# Altium project PCB_ProjectInz.PrjPcb
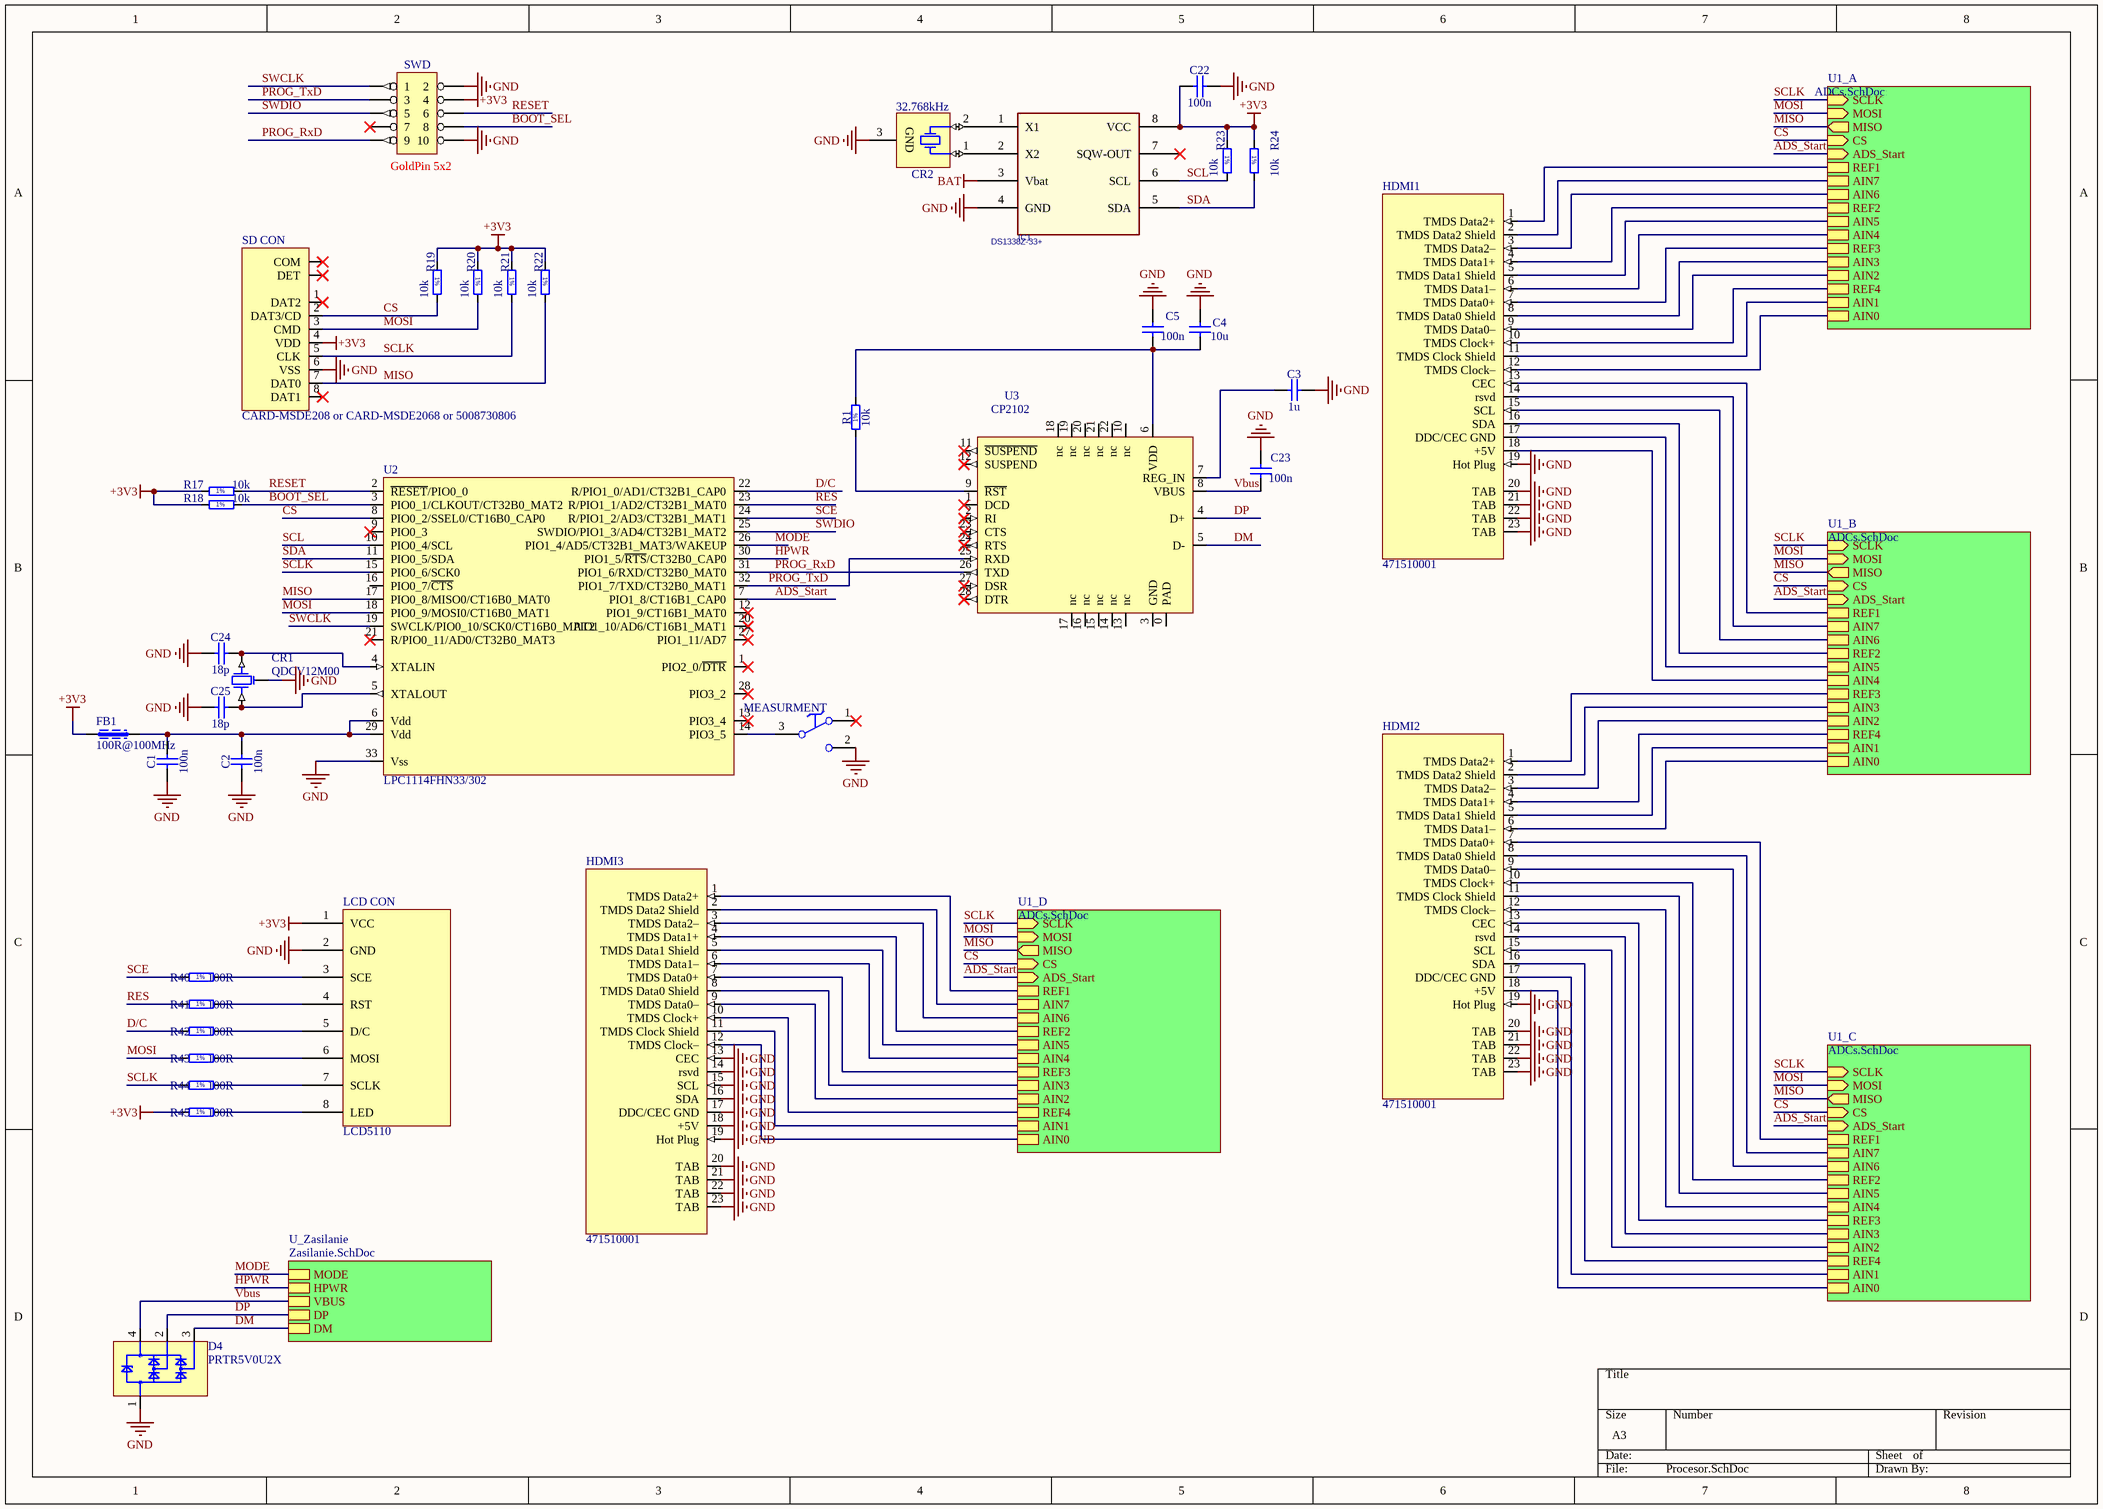
[diagram p0: Procesor.SchDoc]
3 sheets, 104 parts. Net scope: hierarchical (ports join the sheet entries above them; power ports are global).
Board file: PCB.PcbDoc
Sheets:
  Procesor.SchDoc
    U1_A = ADCs.SchDoc
    U1_B = ADCs.SchDoc
    U1_C = ADCs.SchDoc
    U1_D = ADCs.SchDoc
    U_Zasilanie = Zasilanie.SchDoc

## Sheet Procesor.SchDoc
size A3

### Parts
C1  100n  [CAPC1005X55N]
C2  100n  [CAPC1005X55N]
C3  1u  [CAPC1608X87N]
C4  10u  [CAPC2012X135N]
C5  100n  [CAPC1005X55N]
C22  100n  [CAPC1005X55N]
C23  100n  [CAPC1005X55N]
C24  18p  [CAPC1608X87N]
C25  18p  [CAPC1608X87N]
CR1  QDCV12M00  [CERAMIC_RES_QDCV]
CR2  32.768kHz  [XTAL_MICRO-CRYSTAL_MS3V-T1R]
D4  PRTR5V0U2X  [sot143b]
FB1  100R@100MHz  [0603L]
HDMI1  471510001  [HDMI_471510001]
HDMI2  471510001  [HDMI_471510001]
HDMI3  471510001  [HDMI_471510001]
IC1  DS1338Z-33+  [SO-8]
LCD_CON  LCD5110  [Goldpin1x8SMD]
MEASURMENT  Switch  [SW_MENTOR_1850]  (value not drawn)
R1  10k  [RESC1005X40N]
R17  10k  [RESC1608X55N]
R18  10k  [RESC1608X55N]
R19  10k  [RESC1005X40N]
R20  10k  [RESC1005X40N]
R21  10k  [RESC1005X40N]
R22  10k  [RESC1005X40N]
R23  10k  [RESC1005X40N]
R24  10k  [RESC1005X40N]
R40  100R  [RESC1005X40N]
R41  100R  [RESC1005X40N]
R42  100R  [RESC1005X40N]
R43  100R  [RESC1005X40N]
R44  100R  [RESC1005X40N]
R45  100R  [RESC1005X40N]
SD_CON  CARD-MSDE208 or CARD-MSDE2068 or 5008730806  [MSDE208]
SWD  GoldPin 5x2  [CON_2x5_MINI]
U2  LPC1114FHN33/302  [HVQFN33_QFN127P600-8N]
U3  CP2102  [QFN28]

### Sub-sheets
U1_A = ADCs.SchDoc: SCLK (in), MOSI (in), MISO (out), CS (in), ADS_Start (in), REF1, AIN7, AIN6, REF2, AIN5, AIN4, REF3, AIN3, REF4, AIN2, AIN1, AIN0
U1_B = ADCs.SchDoc: SCLK (in), MOSI (in), MISO (out), CS (in), ADS_Start (in), REF1, AIN7, AIN6, REF2, AIN5, AIN4, REF3, AIN3, REF4, AIN2, AIN1, AIN0
U1_C = ADCs.SchDoc: SCLK (in), MOSI (in), MISO (out), CS (in), ADS_Start (in), REF1, AIN7, AIN6, REF2, AIN5, AIN4, REF3, AIN3, REF4, AIN2, AIN1, AIN0
U1_D = ADCs.SchDoc: SCLK (in), MOSI (in), MISO (out), CS (in), ADS_Start (in), REF1, AIN7, AIN6, REF2, AIN5, AIN4, REF3, AIN3, REF4, AIN2, AIN1, AIN0
U_Zasilanie = Zasilanie.SchDoc: DM, DP, VBUS, HPWR, MODE

### Nets
+3V3: C22.1 FB1.1 IC1.8(VCC) LCD_CON.1(VCC) R17.1 R18.1 R19.1 R20.1 R21.1 R22.1 R23.1 R24.1 R45.1 SD_CON.4(VDD) SWD.4
BAT: IC1.3(Vbat)
GND: C1.1 C2.1 C3.2 C4.1 C5.2 C22.2 C23.2 C24.1 C25.1 CR1.2 CR2.3(GND) D4.1 HDMI1.19(Hot_Plug) HDMI1.20(TAB) HDMI1.21(TAB) HDMI1.22(TAB) HDMI1.23(TAB) HDMI2.19(Hot_Plug) HDMI2.20(TAB) HDMI2.21(TAB) HDMI2.22(TAB) HDMI2.23(TAB) HDMI3.13(CEC) HDMI3.14(rsvd) HDMI3.15(SCL) HDMI3.16(SDA) HDMI3.17(DDC/CEC_GND) HDMI3.18(+5V) HDMI3.19(Hot_Plug) HDMI3.20(TAB) HDMI3.21(TAB) HDMI3.22(TAB) HDMI3.23(TAB) IC1.4(GND) LCD_CON.2(GND) MEASURMENT.2 SD_CON.6(VSS) SWD.2 SWD.10 U2.33(Vss)
Vbus: C23.1 D4.4 U3.8(VBUS) ; sheet U_Zasilanie/VBUS
ADS_Start: U2.7(PIO1_8/CT16B1_CAP0) ; sheet U1_A/ADS_Start, sheet U1_B/ADS_Start, sheet U1_C/ADS_Start, sheet U1_D/ADS_Start
BOOT_SEL: R18.2 SWD.8 U2.3(PIO0_1/CLKOUT/CT32B0_MAT2)
CS: R19.2 SD_CON.2(DAT3/CD) U2.8(PIO0_2/SSEL0/CT16B0_CAP0) ; sheet U1_A/CS, sheet U1_B/CS, sheet U1_C/CS, sheet U1_D/CS
D/C: R42.1 U2.22(R/PIO1_0/AD1/CT32B1_CAP0)
DM: D4.3 U3.5(D-) ; sheet U_Zasilanie/DM
DP: D4.2 U3.4(D+) ; sheet U_Zasilanie/DP
HPWR: U2.30(PIO1_5/~{RTS}/CT32B0_CAP0) ; sheet U_Zasilanie/HPWR
MISO: R22.2 SD_CON.7(DAT0) U2.17(PIO0_8/MISO0/CT16B0_MAT0) ; sheet U1_A/MISO, sheet U1_B/MISO, sheet U1_C/MISO, sheet U1_D/MISO
MODE: U2.26(PIO1_4/AD5/CT32B1_MAT3/WAKEUP) ; sheet U_Zasilanie/MODE
MOSI: R20.2 R43.1 SD_CON.3(CMD) U2.18(PIO0_9/MOSI0/CT16B0_MAT1) ; sheet U1_A/MOSI, sheet U1_B/MOSI, sheet U1_C/MOSI, sheet U1_D/MOSI
PROG_RxD: SWD.9 U2.31(PIO1_6/RXD/CT32B0_MAT0) U3.26(TXD)
PROG_TxD: SWD.3 U2.32(PIO1_7/TXD/CT32B0_MAT1) U3.25(RXD)
RES: R41.1 U2.23(R/PIO1_1/AD2/CT32B1_MAT0)
RESET: R17.2 SWD.6 U2.2(~{RESET}/PIO0_0)
SCE: R40.1 U2.24(R/PIO1_2/AD3/CT32B1_MAT1)
SCL: IC1.6(SCL) R23.2 U2.10(PIO0_4/SCL)
SCLK: R21.2 R44.1 SD_CON.5(CLK) U2.15(PIO0_6/SCK0) ; sheet U1_A/SCLK, sheet U1_B/SCLK, sheet U1_C/SCLK, sheet U1_D/SCLK
SDA: IC1.5(SDA) R24.2 U2.11(PIO0_5/SDA)
SWCLK: SWD.1 U2.19(SWCLK/PIO0_10/SCK0/CT16B0_MAT2)
SWDIO: SWD.5 U2.25(SWDIO/PIO1_3/AD4/CT32B1_MAT2)
NetC1_2: C1.2 C2.2 FB1.2 U2.6(Vdd) U2.29(Vdd)
NetC3_1: C3.1 U3.7(REG_IN)
NetC4_2: C4.2 C5.1 R1.2 U3.6(VDD)
NetC24_2: C24.2 CR1.1 U2.4(XTALIN)
NetC25_2: C25.2 CR1.3 U2.5(XTALOUT)
NetCR2_1: CR2.1(X) IC1.2(X2)
NetCR2_2: CR2.2(X) IC1.1(X1)
NetD1A_1: HDMI1.1(TMDS_Data2+) HDMI1.4(TMDS_Data1+) HDMI1.7(TMDS_Data0+) HDMI1.10(TMDS_Clock+) ; sheet U1_A/REF1, sheet U1_A/REF2, sheet U1_A/REF3, sheet U1_A/REF4
NetD1A_3: HDMI1.2(TMDS_Data2_Shield) ; sheet U1_A/AIN7
NetD1A_6: HDMI1.3(TMDS_Data2–) ; sheet U1_A/AIN6
NetD1B_1: HDMI1.13(CEC) HDMI1.16(SDA) HDMI2.1(TMDS_Data2+) HDMI2.4(TMDS_Data1+) ; sheet U1_B/REF1, sheet U1_B/REF2, sheet U1_B/REF3, sheet U1_B/REF4
NetD1B_3: HDMI1.14(rsvd) ; sheet U1_B/AIN7
NetD1B_6: HDMI1.15(SCL) ; sheet U1_B/AIN6
NetD1C_1: HDMI2.7(TMDS_Data0+) HDMI2.10(TMDS_Clock+) HDMI2.13(CEC) HDMI2.16(SDA) ; sheet U1_C/REF1, sheet U1_C/REF2, sheet U1_C/REF3, sheet U1_C/REF4
NetD1C_3: HDMI2.8(TMDS_Data0_Shield) ; sheet U1_C/AIN7
NetD1C_6: HDMI2.9(TMDS_Data0–) ; sheet U1_C/AIN6
NetD1D_1: HDMI3.1(TMDS_Data2+) HDMI3.4(TMDS_Data1+) HDMI3.7(TMDS_Data0+) HDMI3.10(TMDS_Clock+) ; sheet U1_D/REF1, sheet U1_D/REF2, sheet U1_D/REF3, sheet U1_D/REF4
NetD1D_3: HDMI3.2(TMDS_Data2_Shield) ; sheet U1_D/AIN7
NetD1D_6: HDMI3.3(TMDS_Data2–) ; sheet U1_D/AIN6
NetD2A_1: HDMI1.5(TMDS_Data1_Shield) ; sheet U1_A/AIN5
NetD2A_3: HDMI1.6(TMDS_Data1–) ; sheet U1_A/AIN4
NetD2A_4: HDMI1.8(TMDS_Data0_Shield) ; sheet U1_A/AIN3
NetD2B_1: HDMI1.17(DDC/CEC_GND) ; sheet U1_B/AIN5
NetD2B_3: HDMI1.18(+5V) ; sheet U1_B/AIN4
NetD2B_4: HDMI2.2(TMDS_Data2_Shield) ; sheet U1_B/AIN3
NetD2C_1: HDMI2.11(TMDS_Clock_Shield) ; sheet U1_C/AIN5
NetD2C_3: HDMI2.12(TMDS_Clock–) ; sheet U1_C/AIN4
NetD2C_4: HDMI2.14(rsvd) ; sheet U1_C/AIN3
NetD2D_1: HDMI3.5(TMDS_Data1_Shield) ; sheet U1_D/AIN5
NetD2D_3: HDMI3.6(TMDS_Data1–) ; sheet U1_D/AIN4
NetD2D_4: HDMI3.8(TMDS_Data0_Shield) ; sheet U1_D/AIN3
NetD3A_1: HDMI1.9(TMDS_Data0–) ; sheet U1_A/AIN2
NetD3A_4: HDMI1.12(TMDS_Clock–) ; sheet U1_A/AIN0
NetD3A_6: HDMI1.11(TMDS_Clock_Shield) ; sheet U1_A/AIN1
NetD3B_1: HDMI2.3(TMDS_Data2–) ; sheet U1_B/AIN2
NetD3B_4: HDMI2.6(TMDS_Data1–) ; sheet U1_B/AIN0
NetD3B_6: HDMI2.5(TMDS_Data1_Shield) ; sheet U1_B/AIN1
NetD3C_1: HDMI2.15(SCL) ; sheet U1_C/AIN2
NetD3C_4: HDMI2.18(+5V) ; sheet U1_C/AIN0
NetD3C_6: HDMI2.17(DDC/CEC_GND) ; sheet U1_C/AIN1
NetD3D_1: HDMI3.9(TMDS_Data0–) ; sheet U1_D/AIN2
NetD3D_4: HDMI3.12(TMDS_Clock–) ; sheet U1_D/AIN0
NetD3D_6: HDMI3.11(TMDS_Clock_Shield) ; sheet U1_D/AIN1
NetLCD_CON_3: LCD_CON.3(SCE) R40.2
NetLCD_CON_4: LCD_CON.4(RST) R41.2
NetLCD_CON_5: LCD_CON.5(D/C) R42.2
NetLCD_CON_6: LCD_CON.6(MOSI) R43.2
NetLCD_CON_7: LCD_CON.7(SCLK) R44.2
NetLCD_CON_8: LCD_CON.8(LED) R45.2
NetMEASURMENT_3: MEASURMENT.3 U2.14(PIO3_5)
NetR1_1: R1.1 U3.9(~{RST})

Not connected (* = marked no-connect by the designer): IC1 7(SQW-OUT)*; MEASURMENT 1*; SD_CON 1(DAT2)* 8(DAT1)* CD(DET)* COM*; SWD 7*; U2 1(PIO2_0/~{DTR})* 9(PIO0_3)* 12(PIO1_9/CT16B1_MAT0)* 13(PIO3_4)* 16(PIO0_7/~{CTS}) 20(PIO1_10/AD6/CT16B1_MAT1)* 21(R/PIO0_11/AD0/CT32B0_MAT3)* 27(PIO1_11/AD7)* 28(PIO3_2)*; U3 0(PAD) 1(DCD)* 2(RI)* 3(GND) 10(nc) 11(~{SUSPEND})* 12(SUSPEND)* 13(nc) 14(nc) 15(nc) 16(nc) 17(nc) 18(nc) 19(nc) 20(nc) 21(nc) 22(nc) 23(CTS)* 24(RTS)* 27(DSR)* 28(DTR)*

### Notes on the sheet
- (in symbol R0402_10K_1%_0.0625W_100PPM) 1%
- (in symbol R0402_10R_1%_0.0625W_200PPM) 1%
- (in symbol R0603_10K_1%_0.1W_100PPM) 1%

### Library data of the parts
C1 C2 C5 C22 C23 = CC0402_100NF_16V_10%_X7R: Non-polarised capacitor; Part Description: SMD Multilayer Chip Ceramic Capacitor; Manufacturer: GENERIC; Manufacturer1 Part Number: 223878715649; Value: 100nF; Voltage: 16V; TC: X7R; Tolerance: ±10%; Table: Capacitors SMD; Part Number: CC0402_100NF_16V_10%_X7R; Component Kind: Standard; Component Type: Standard; Pin Count: 2; Status: Not Recommended; Manufacturer Part Number: CC0402_100NF_16V_10%_X7R; Case: 0402; Mounted: Yes; Socket: No; SMD: Yes; Manufacturer1 Example: PHYCOMP; Manufacturer1 ComponentHeight: 0.55mm; HelpURL: \\cern.ch\dfs\Applications\Altium\Datasheets\CC0402_X7R_PHYCOMP.pdf; Author: CERN DEM JLC; CreateDate: 2007-12-03; LatestRevisionDate: 2007-12-03
C3 = CC0603_1UF_16V_10%_X7R: Non-polarised capacitor; Part Description: SMD Multilayer Chip Ceramic Capacitor; Manufacturer: GENERIC; Manufacturer1 Part Number: 223824613663; Value: 1uF; Voltage: 16V; TC: X7R; Tolerance: ±10%; Table: Capacitors SMD; Part Number: CC0603_1UF_16V_10%_X7R; Component Kind: Standard; Component Type: Standard; Pin Count: 2; Status: Preferred; Manufacturer Part Number: CC0603_1uF_16V_10%_X7R; Case: 0603; Mounted: Yes; Socket: No; SMD: Yes; Manufacturer1 Example: PHYCOMP; Manufacturer1 ComponentHeight: 0.87mm; HelpURL: \\cern.ch\dfs\Applications\Altium\Datasheets\CC0805_X5R_PHYCOMP_HC.pdf; Author: CERN DEM JLC; CreateDate: 2007-12-03; LatestRevisionDate: 2007-12-03
C4 = CC0805_10UF_16V_10%_X5R: Non-polarised capacitor; Part Description: SMD Multilayer Chip Ceramic Capacitor; Manufacturer: GENERIC; Manufacturer1 Part Number: C0805C106K4PAC; Value: 10uF; Voltage: 16V; TC: X5R; Tolerance: ±10%; Table: Capacitors SMD; Part Number: CC0805_10UF_16V_10%_X5R; Component Kind: Standard; Component Type: Standard; Pin Count: 2; Status: Preferred; Manufacturer Part Number: CC0805_10UF_16V_10%_X5R; Case: 0805; Mounted: Yes; Socket: No; SMD: Yes; Manufacturer1 Example: KEMET; Manufacturer1 ComponentHeight: 1.4mm; HelpURL: \\cern.ch\dfs\Applications\Altium\Datasheets\CC1206_X5R_KEMET.pdf; Author: CERN DEM JLC; CreateDate: 2007-12-03; LatestRevisionDate: 2007-12-03
C24 C25 = CC0603_18PF_50V_5%_NP0: Non-polarised capacitor; Part Description: SMD Multilayer Chip Ceramic Capacitor; Manufacturer: GENERIC; Manufacturer1 Part Number: 223886715189; Value: 18pF; Voltage: 50V; TC: NP0; Tolerance: ±5%; Table: Capacitors SMD; Part Number: CC0603_18PF_50V_5%_NP0; Component Kind: Standard; Component Type: Standard; Pin Count: 2; Status: Preferred; Manufacturer Part Number: CC0603_18PF_50V_5%_NP0; Case: 0603; Mounted: Yes; Socket: No; SMD: Yes; Manufacturer1 Example: PHYCOMP; Manufacturer1 ComponentHeight: 0.87mm; HelpURL: \\cern.ch\dfs\Applications\Altium\Datasheets\CC0603_NP0_PHYCOMP.pdf; Author: CERN DEM JLC; CreateDate: 2007-12-03; LatestRevisionDate: 2007-12-03
CR1 = X_CERAMIC_RES: ceramic resonator QCC(QDCV)12.00 (Maritex)
CR2 = XTAL_32.768 KHZ_MICRO-CRYSTAL_MS3V-T1R 32.768 KHZ 12.5PF 20PPM: Crystal 3 pins 1=XTAL 2=XTAL 3=GND; Part Description: Tolerance:± 20ppm, -40°C to +85°C, 12.5pF,  Surface Mount Crystal, MS3V-T1R Serie; Manufacturer: MICRO CRYSTAL; Manufacturer Part Number: MS3V-T1R 32.768 KHZ 12.5PF 20PPM TAQC; Table: Crystals & Oscillators; Part Number: XTAL_32.768 KHZ_MICRO-CRYSTAL_MS3V-T1R 32.768 KHZ 12.5PF 20PPM; Component Kind: Standard; Component Type: Standard; PackageDescription: 2 Pins, 1.4 x 5.2 x 1.4mm , SMD Crystal, MS3V-T1R Serie; Value: 32.768kHz; Pin Count: 3; Mounted: Yes; Socket: No; SMD: Yes; ComponentHeight: 1.48mm; HelpURL: \\cern.ch\dfs\Applications\Altium\Datasheets\XTAL_MICRO-CRYSTAL_MS3V-T1R.pdf; Author: CERN DEM JLC; CreateDate: 2013-02-21; LatestRevisionDate: 2013-02-21
D4 = D_TVS_PRTR5V0U2X: dual 5.5 ESD transient voltage suppressor
FB1 = L_FERRITE_BEAD: ferrite bead
HDMI1-HDMI3 = CON_HDMI_OUT: HDMI connector with flante (Multicomp, Farnell); Supplier 1: Farnell; Supplier Part Number 1: 1428260
IC1 = RTC_DS1338U-33: RTC; Part Number: 1.1.05.12.006; Manufacture: Maxim; Name: INS16799019; Spec: DS1338U-33; Type: IC-else; Supplier 1: Newark; Supplier Part Number 1: 27K7425
MEASURMENT = SW_MENTOR_1850.1031: SPDT Switch; Part Description: SPDT Toggle Switch - PCB Edge Mounting; Manufacturer: MENTOR; SCEM: 07.88.10.140.4; Table: Switches; Part Number: SW_MENTOR_1850.1031; Component Kind: Standard; Component Type: Standard; Pin Count: 3; PackageDescription: SPDT Switch - PCB Edge Mounting - MENTOR_1850; Family: Switch; Mounted: Yes; Socket: No; SMD: No; Status: None; Manufacturer Part Number: 1850.1031; ComponentHeight: 9.95mm; HelpURL: \\cern.ch\dfs\Applications\Altium\Datasheets\SW_MENTOR_1850.1031.pdf; Author: CERN DEM JMW; CreateDate: 2008-10-03; LatestRevisionDate: 2008-10-03
R1 R19-R24 = R0402_10K_1%_0.0625W_100PPM: Resistor - 1%; Part Description: General Purpose Thick Film Chip Resistor; Manufacturer: GENERIC; Manufacturer1 Part Number: 232270671003; TC: ±100ppm/°C; Table: Resistors SMD; Component Kind: Standard; Component Type: Standard; Pin Count: 2; Value: 10k; Status: Not recommended; Power: 0.0625W; Tolerance: ±1%; Manufacturer Part Number: R0402_10K_1%_0.0625W_100PPM; Case: 0402; Mounted: Yes; Socket: No; SMD: Yes; Manufacturer1 Example: PHYCOMP; Manufacturer1 ComponentHeight: 0.4mm; HelpURL: \\cern.ch\dfs\Applications\Altium\Datasheets\R0402_Phycomp_RC0402.pdf; Author: CERN DEM JLC; CreateDate: 2007-12-03; LatestRevisionDate: 2008-03-13
  R1 R19 R20 R22-R24: Part Number: R0402_10K_1%_0.0625W_100PPM
R17 R18 = R0603_10K_1%_0.1W_100PPM: Resistor - 1%; Part Description: General Purpose Thick Film Chip Resistor; Manufacturer: GENERIC; Manufacturer1 Part Number: NRC06F1002TRF; Power: 0.1W; TC: ±100ppm/°C; Table: Resistors SMD; Part Number: R0603_10K_1%_0.1W_100PPM; Component Kind: Standard; Component Type: Standard; Pin Count: 2; Value: 10k; Status: Preferred; Tolerance: ±1%; Manufacturer Part Number: R0603_10K_1%_0.1W_100PPM; Case: 0603; Mounted: Yes; Socket: No; SMD: Yes; Manufacturer1 Example: NIC COMPONENT; Manufacturer1 ComponentHeight: 0.55mm; HelpURL: \\cern.ch\dfs\Applications\Altium\Datasheets\R0603_NIC_NRC.pdf; Author: CERN DEM JLC; CreateDate: 2007-12-03; LatestRevisionDate: 2008-03-13
R40-R45 = R0402_10R_1%_0.0625W_200PPM: Resistor - 1%; Part Description: General Purpose Thick Film Chip Resistor; Manufacturer: GENERIC; Manufacturer1 Part Number: 232270671009L; Value: 10; TC: ±200ppm/°C; Table: Resistors SMD; Part Number: R0402_10R_1%_0.0625W_200PPM; Component Kind: Standard; Component Type: Standard; Pin Count: 2; Status: Not recommended; Power: 0.0625W; Tolerance: ±1%; Manufacturer Part Number: R0402_10R_1%_0.0625W_200PPM; Case: 0402; Mounted: Yes; Socket: No; SMD: Yes; Manufacturer1 Example: YAGEO PHYCOMP; Manufacturer1 ComponentHeight: 0.4mm; HelpURL: \\cern.ch\dfs\Applications\Altium\Datasheets\R0402_Phycomp_RC0402.pdf; Author: CERN DEM JLC; CreateDate: 2009-06-24; LatestRevisionDate: 2012-10-17
SD_CON = CON_CARD_microSD_push-push: Secure Digital Cards socket (Maritex); Supplier 1: Arrow; Supplier Part Number 1: 46118222S9776661N3303
SWD = HEADER 5X2
U2 = UPC_LPC1111

## Sheet ADCs.SchDoc
size A4
Used 4 times, as channels U1_A, U1_B, U1_C, U1_D. Parts and nets are listed once, with the designators drawn on the sheet.
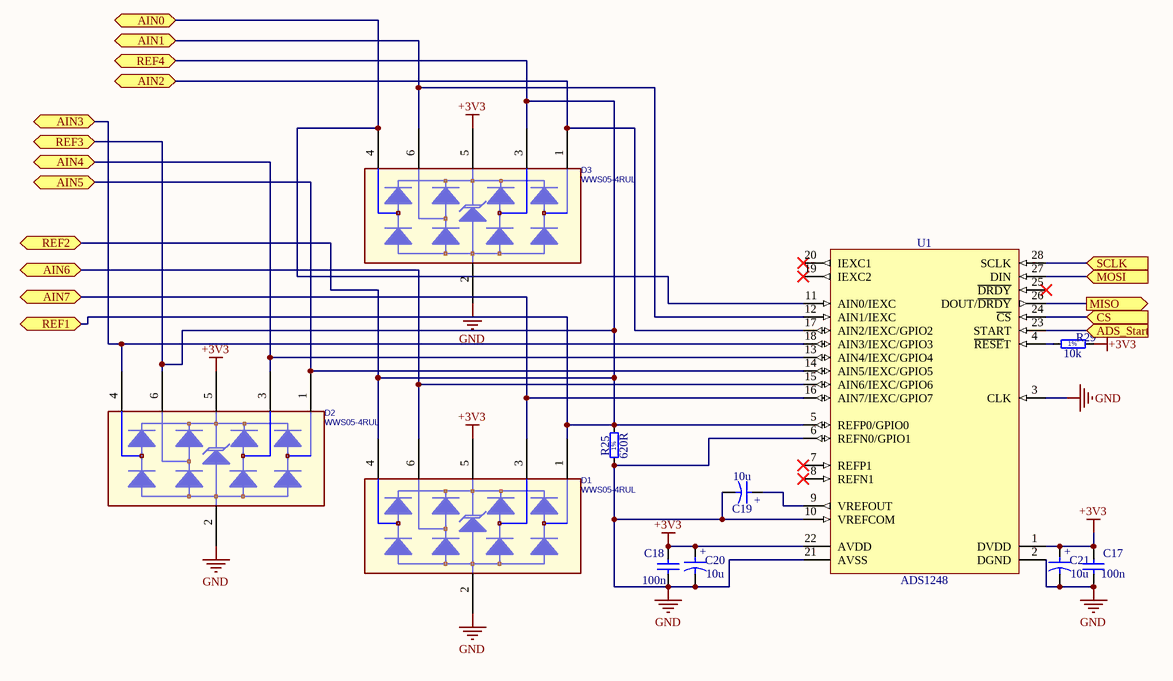
[diagram p1: ADCs.SchDoc]

### Parts
C17  100n  [CAPC1005X55N]
C18  100n  [CAPC1005X55N]
C19  10u  [CAPMP3216X180N]
C20  10u  [CAPMP3216X180N]
C21  10u  [CAPMP3216X180N]
D1  WWS05-4RUL  [SOT23-6]
D2  WWS05-4RUL  [SOT23-6]
D3  WWS05-4RUL  [SOT23-6]
R25  620R  [RESC1005X40N]
R29  10k  [RESC1005X40N]
U1  ADS1248  [SOP65P640X120-28N]

### Ports
ADS_Start (in), AIN0, AIN1, AIN2, AIN3, AIN4, AIN5, AIN6, AIN7, CS (in), MISO (out), MOSI (in), REF1, REF2, REF3, REF4, SCLK (in)

### Nets
+3V3: C17.2 C18.2 C20.1 C21.1 D1.5 D2.5 D3.5 R29.2 U1.1(DVDD) U1.22(AVDD)
GND: C17.1 C18.1 C19.2 C20.2 C21.2 D1.2 D2.2 D3.2 R25.1 U1.2(DGND) U1.3(CLK) U1.6(REFN0/GPIO1) U1.10(VREFCOM) U1.21(AVSS)
ADS_Start: U1.23(START) ; port ADS_Start
AIN0: D3.4 U1.11(AIN0/IEXC) ; port AIN0
AIN1: D3.6 U1.12(AIN1/IEXC) ; port AIN1
AIN2: D3.1 U1.17(AIN2/IEXC/GPIO2) ; port AIN2
AIN3: D2.4 U1.18(AIN3/IEXC/GPIO3) ; port AIN3
AIN4: D2.3 U1.13(AIN4/IEXC/GPIO4) ; port AIN4
AIN5: D2.1 U1.14(AIN5/IEXC/GPIO5) ; port AIN5
AIN6: D1.6 U1.15(AIN6/IEXC/GPIO6) ; port AIN6
AIN7: D1.3 U1.16(AIN7/IEXC/GPIO7) ; port AIN7
CS: U1.24(~{CS}) ; port CS
MISO: U1.26(DOUT/~{DRDY}) ; port MISO
MOSI: U1.27(DIN) ; port MOSI
REF1: D1.1 D1.4 D2.6 D3.3 R25.2 U1.5(REFP0/GPIO0) ; port REF1, port REF2, port REF3, port REF4
SCLK: U1.28(SCLK) ; port SCLK
NetC19_1: C19.1 U1.9(VREFOUT)
NetR29_1: R29.1 U1.4(~{RESE}T)

Not connected (* = marked no-connect by the designer): U1 7(REFP1)* 8(REFN1)* 19(IEXC2)* 20(IEXC1)* 25(~{DRDY})*

### Channels
U1_A: designators end in A; ports ADS_Start=ADS_Start AIN0=NetD3A_4 AIN1=NetD3A_6 AIN2=NetD3A_1 AIN3=NetD2A_4 AIN4=NetD2A_3 AIN5=NetD2A_1 AIN6=NetD1A_6 AIN7=NetD1A_3 CS=CS MISO=MISO MOSI=MOSI REF1=NetD1A_1 REF2=NetD1A_1 REF3=NetD1A_1 REF4=NetD1A_1 SCLK=SCLK
U1_B: designators end in B; ports ADS_Start=ADS_Start AIN0=NetD3B_4 AIN1=NetD3B_6 AIN2=NetD3B_1 AIN3=NetD2B_4 AIN4=NetD2B_3 AIN5=NetD2B_1 AIN6=NetD1B_6 AIN7=NetD1B_3 CS=CS MISO=MISO MOSI=MOSI REF1=NetD1B_1 REF2=NetD1B_1 REF3=NetD1B_1 REF4=NetD1B_1 SCLK=SCLK
U1_C: designators end in C; ports ADS_Start=ADS_Start AIN0=NetD3C_4 AIN1=NetD3C_6 AIN2=NetD3C_1 AIN3=NetD2C_4 AIN4=NetD2C_3 AIN5=NetD2C_1 AIN6=NetD1C_6 AIN7=NetD1C_3 CS=CS MISO=MISO MOSI=MOSI REF1=NetD1C_1 REF2=NetD1C_1 REF3=NetD1C_1 REF4=NetD1C_1 SCLK=SCLK
U1_D: designators end in D; ports ADS_Start=ADS_Start AIN0=NetD3D_4 AIN1=NetD3D_6 AIN2=NetD3D_1 AIN3=NetD2D_4 AIN4=NetD2D_3 AIN5=NetD2D_1 AIN6=NetD1D_6 AIN7=NetD1D_3 CS=CS MISO=MISO MOSI=MOSI REF1=NetD1D_1 REF2=NetD1D_1 REF3=NetD1D_1 REF4=NetD1D_1 SCLK=SCLK

### Notes on the sheet
- (in symbol CTE7343-31_10UF_25V_10%) +
- (in symbol R0402_10K_1%_0.0625W_100PPM) 1%
- (in symbol R0402_620R_1%_0.0625W_100PPM) 1%

### Library data of the parts
C17 C18 = CC0402_100NF_16V_10%_X7R: as C1 on sheet Procesor; Part Number: CC0402_100NF_16V_10%_X7R; Component Kind: Standard; Component Type: Standard; Pin Count: 2; Status: Not Recommended; Manufacturer Part Number: CC0402_100NF_16V_10%_X7R; Case: 0402; Mounted: Yes; Socket: No; SMD: Yes; Manufacturer1 Example: PHYCOMP; Manufacturer1 ComponentHeight: 0.55mm; HelpURL: \\cern.ch\dfs\Applications\Altium\Datasheets\CC0402_X7R_PHYCOMP.pdf; Author: CERN DEM JLC; CreateDate: 2007-12-03; LatestRevisionDate: 2007-12-03
C19-C21 = CTE7343-31_10UF_25V_10%: Polarised capacitor; Part Description: Solid Tantalum Chip Capacitor; Manufacturer: GENERIC; Manufacturer1 Part Number: TAJD106K025R; Value: 10uF; Voltage: 25V; Tolerance: ±10%; Table: Capacitors SMD; Part Number: CTE7343-31_10UF_25V_10%; Component Kind: Standard; Component Type: Standard; Footprint: CAPMP7343X310N; Pin Count: 2; Status: Preferred; Manufacturer Part Number: CTE7343-31_10UF_25V_10%; Case: D; Mounted: Yes; Socket: No; SMD: Yes; Manufacturer1 Example: AVX; Manufacturer1 ComponentHeight: 3.1mm; HelpURL: \\cern.ch\dfs\Applications\Altium\Datasheets\CTE_AVX_TAJ.pdf; Author: CERN DEM JMW; CreateDate: 2008-10-17; LatestRevisionDate: 2008-10-17
D1-D3 = D_TVS_WWS05-4RUL: TVS, 5V; Specification: SMD,ESD COMPONENT,ROHS; Description: DIODE,RCLAMP0524P,SEMTECH
R25 = R0402_620R_1%_0.0625W_100PPM: Resistor - 1%; Part Description: General Purpose Thick Film Chip Resistor; Manufacturer: GENERIC; Manufacturer1 Part Number: 232270676201L; Value: 620; TC: ±100ppm/°C; Table: Resistors SMD; Part Number: R0402_620R_1%_0.0625W_100PPM; Component Kind: Standard; Component Type: Standard; Pin Count: 2; Status: Not recommended; Power: 0.0625W; Tolerance: ±1%; Manufacturer Part Number: R0402_620R_1%_0.0625W_100PPM; Case: 0402; Mounted: Yes; Socket: No; SMD: Yes; Manufacturer1 Example: YAGEO PHYCOMP; Manufacturer1 ComponentHeight: 0.4mm; HelpURL: \\cern.ch\dfs\Applications\Altium\Datasheets\R0402_Phycomp_RC0402.pdf; Author: CERN DEM JLC; CreateDate: 2007-12-03; LatestRevisionDate: 2012-10-17
R29 = R0402_10K_1%_0.0625W_100PPM: Resistor - 1%; Part Description: General Purpose Thick Film Chip Resistor; Manufacturer: GENERIC; Manufacturer1 Part Number: 232270671003L; TC: ±100ppm/°C; Table: Resistors SMD; Part Number: R0402_10K_1%_0.0625W_100PPM; Component Kind: Standard; Component Type: Standard; Pin Count: 2; Value: 10k; Status: Not recommended; Power: 0.0625W; Tolerance: ±1%; Manufacturer Part Number: R0402_10K_1%_0.0625W_100PPM; Case: 0402; Mounted: Yes; Socket: No; SMD: Yes; Manufacturer1 Example: YAGEO PHYCOMP; Manufacturer1 ComponentHeight: 0.4mm; HelpURL: \\cern.ch\dfs\Applications\Altium\Datasheets\R0402_Phycomp_RC0402.pdf; Author: CERN DEM JLC; CreateDate: 2007-12-03; LatestRevisionDate: 2012-10-17
U1 = ADS1248IPWR: 24-Bit Analog-to-Digital Converter for Temperature Sensors; Manufacturer: TEXAS INSTRUMENTS; Table: Analog & Interface; Part Number: ADS1248IPWR; Component Kind: Standard; Component Type: Standard; Device: ADS1248IPWR; PackageDescription: SOP, 0.65mm Pitch; 28 Pin, 4.40mm W X 9.70mm L X 1.20mm H body, IPC Medium Density; Part Description: 24-Bit Analog-to-Digital Converter for Temperature Sensors; Manufacturer Part Number: ADS1248IPWR; Pin Count: 28; Case: TSSOP28; Mounted: Yes; Socket: No; SMD: Yes; ComponentHeight: 1.2mm; Author: CERN DEM JLC; HelpURL: \\cern.ch\dfs\Applications\Altium\Datasheets\ADS1248IPWR.pdf; CreateDate: 2012-03-19; LatestRevisionDate: 2012-03-19

## Sheet Zasilanie.SchDoc
size A4
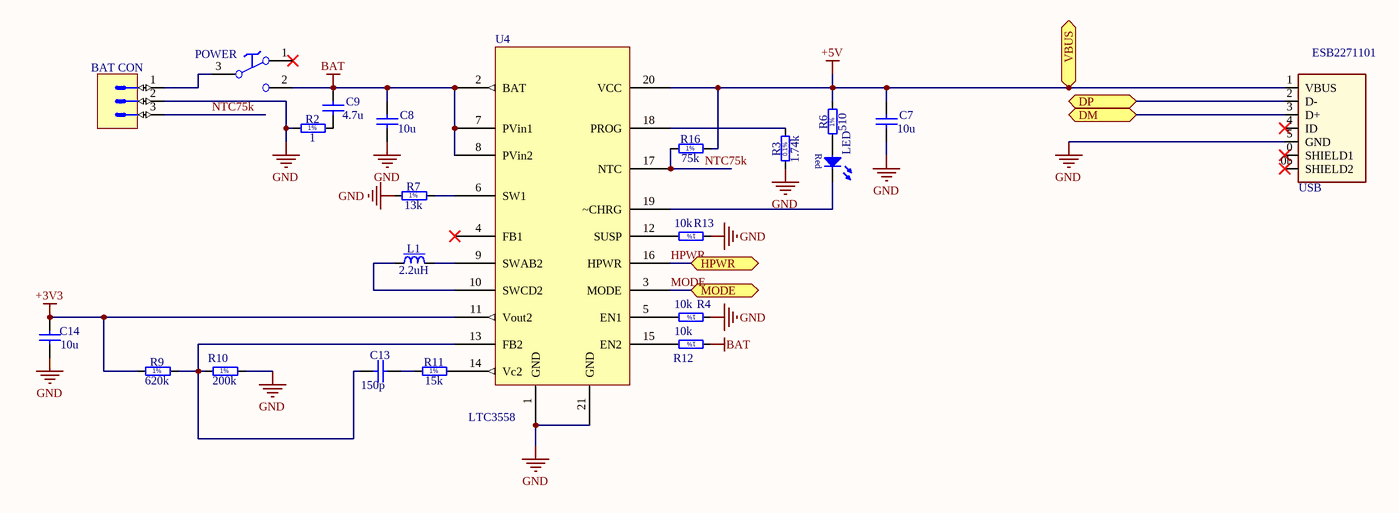
[diagram p2: Zasilanie.SchDoc]

### Parts
BAT_CON  KK®  [MOLEX_22-05-7038]  (value not drawn)
C7  10u  [CAPC2012X135N]
C8  10u  [CAPC2012X135N]
C9  4.7u  [CAPC1608X87N]
C13  150p  [CAPC1005X55N]
C14  10u  [CAPC2012X135N]
L1  2.2uH  [IND_WURTH_WE-TPC_4828]
LED  Red  [LED_AVAGO_HSMC-C150]  (value not drawn)
POWER  Switch  [SW_MENTOR_1850]  (value not drawn)
R2  1  [RESC1005X40N]
R3  1.74k  [RESC1608X55N]
R4  10k  [RESC1005X40N]
R6  510  [RESC1005X40N]
R7  13k  [RESC1005X40N]
R9  620k  [RESC1005X40N]
R10  200k  [RESC1005X40N]
R11  15k  [RESC1005X40N]
R12  10k  [RESC1005X40N]
R13  10k  [RESC1005X40N]
R16  75k  [RESC1005X40N]
U4  LTC3558  [LTC3558nowe2]
USB  ESB2271101  [USB_MICRO_ESB2271101]

### Ports
DM, DP, HPWR, MODE, VBUS

### Nets
+3V3: C14.1 R9.1 U4.11(Vout2)
+5V: C7.1 R6.2 R16.2 U4.20(VCC) USB.1(VBUS) ; port VBUS  [project net Vbus]
BAT: C8.1 C9.1 POWER.2 R12.1 U4.2(BAT) U4.7(PVin1) U4.8(PVin2)
GND: BAT_CON.2 C7.2 C8.2 C14.2 R2.1 R3.1 R4.1 R7.1 R10.2 R13.1 U4.1(GND) U4.21(GND) USB.5(GND)
DM: USB.3(D+) ; port DM
DP: USB.2(D-) ; port DP
HPWR: U4.16(HPWR) ; port HPWR
MODE: U4.3(MODE) ; port MODE
NTC75k: BAT_CON.3 R16.1 U4.17(NTC)
NetBAT_CON_1: BAT_CON.1 POWER.3
NetC9_2: C9.2 R2.2
NetC13_1: C13.1 R9.2 R10.1 U4.13(FB2)
NetC13_2: C13.2 R11.1
NetL1_1: L1.1 U4.10(SWCD2)
NetL1_2: L1.2 U4.9(SWAB2)
NetLED_1: LED.1(C) U4.19(~CHRG)
NetLED_2: LED.2(A) R6.1
NetR3_2: R3.2 U4.18(PROG)
NetR4_2: R4.2 U4.5(EN1)
NetR7_2: R7.2 U4.6(SW1)
NetR11_2: R11.2 U4.14(Vc2)
NetR12_2: R12.2 U4.15(EN2)
NetR13_2: R13.2 U4.12(SUSP)
NetUSB_0: USB.0(SHIELD1) USB.0a(SHIELD1)
NetUSB_0b: USB.0b(SHIELD2) USB.0c(SHIELD2)

Not connected (* = marked no-connect by the designer): POWER 1*; U4 4(FB1)*; USB 4(ID)*

### Notes on the sheet
- (in symbol R0402_1R_1%_0.0625W_200PPM) 1%
- (in symbol R0402_10K_1%_0.0625W_100PPM) 1%
- (in symbol R0402_13K_1%_0.0625W_100PPM) 1%
- (in symbol R0402_75K_1%_0.0625W_100PPM) 1%
- (in symbol R0402_200K_1%_0.0625W_100PPM) 1%
- (in symbol R0402_510R_1%_0.0625W_100PPM) 1%
- (in symbol R0402_620R_1%_0.0625W_100PPM) 1%
- (in symbol R0603_1K74_0.1%_0.063W_10PPM) 0.1%

### Library data of the parts
BAT_CON = MOLEX_22-05-7038: Connector 3 Male; Part Description: 2.54mm (.100") Pitch KK® Wire-To-Board Header, Right Angle, With Friction Lock, 3 Circuits; Manufacturer: MOLEX; Part Number: MOLEX_22-05-7038; Component Kind: Standard; Component Type: Standard; Pin Count: 3; Family: KK®; Mounted: Yes; Socket: No; SMD: No; Status: None; Manufacturer Part Number: 22-05-7038; ComponentHeight: 5.8mm; HelpURL: \\cern.ch\dfs\Applications\Altium\Datasheets\MOLEX_22-05-7038.pdf; Author: CERN DEM JLC; CreateDate: 2012-09-19; LatestRevisionDate: 2012-09-19; Table: MOLEX
C7 C8 C14 = CC0805_10UF_16V_10%_X5R: as C4 on sheet Procesor; Part Number: CC0805_10UF_16V_10%_X5R; Component Kind: Standard; Component Type: Standard; Pin Count: 2; Status: Preferred; Manufacturer Part Number: CC0805_10UF_16V_10%_X5R; Case: 0805; Mounted: Yes; Socket: No; SMD: Yes; Manufacturer1 Example: KEMET; Manufacturer1 ComponentHeight: 1.4mm; HelpURL: \\cern.ch\dfs\Applications\Altium\Datasheets\CC1206_X5R_KEMET.pdf; Author: CERN DEM JLC; CreateDate: 2007-12-03; LatestRevisionDate: 2007-12-03
C9 = CC0603_4.7UF_6.3V_10%_X5R: Non-polarised capacitor; Part Description: SMD Multilayer Chip Ceramic Capacitor; Manufacturer: GENERIC; Manufacturer1 Part Number: 225520613672; Value: 4.7uF; Voltage: 6.3V; TC: X5R; Tolerance: ±10%; Table: Capacitors SMD; Part Number: CC0603_4.7UF_6.3V_10%_X5R; Component Kind: Standard; Component Type: Standard; Pin Count: 2; Status: Preferred; Manufacturer Part Number: CC0603_4.7uF_6.3V_10%_X5R; Case: 0603; Mounted: Yes; Socket: No; SMD: Yes; Manufacturer1 Example: PHYCOMP; Manufacturer1 ComponentHeight: 0.87mm; HelpURL: \\cern.ch\dfs\Applications\Altium\Datasheets\CC0805_X5R_PHYCOMP_HC.pdf; Author: CERN DEM JLC; CreateDate: 2007-12-03; LatestRevisionDate: 2007-12-03
C13 = CC0402_150PF_50V_5%_NP0: Non-polarised capacitor; Part Description: SMD Multilayer Chip Ceramic Capacitor; Manufacturer: GENERIC; Manufacturer1 Part Number: 223886915151; Value: 150pF; Voltage: 50V; TC: NP0; Tolerance: ±5%; Table: Capacitors SMD; Part Number: CC0402_150PF_50V_5%_NP0; Component Kind: Standard; Component Type: Standard; Pin Count: 2; Status: Not Recommended; Manufacturer Part Number: CC0402_150PF_50V_5%_NP0; Case: 0402; Mounted: Yes; Socket: No; SMD: Yes; Manufacturer1 Example: PHYCOMP; Manufacturer1 ComponentHeight: 0.55mm; HelpURL: \\cern.ch\dfs\Applications\Altium\Datasheets\CC0402_NP0_PHYCOMP.pdf; Author: CERN DEM JLC; CreateDate: 2007-12-03; LatestRevisionDate: 2007-12-03
L1 = IND_2.2UH_30%_WURTH_WE-TPC_7440430022: Inductor With Magnetic core; Part Description: Shielded Tiny Power Inductor (WE-TPC Serie); Manufacturer: WURTH ELEKTRONIK; Power: 2.5A; Resistance: 0.023R; Tolerance: ±30%; Table: Inductors SMD; Part Number: IND_2.2UH_30%_WURTH_WE-TPC_7440430022; Component Kind: Standard; Component Type: Standard; Pin Count: 2; Value: 2.2uH; Status: None; Manufacturer Part Number: 7440430022; Mounted: Yes; Socket: No; SMD: Yes; ComponentHeight: 3mm; HelpURL: \\cern.ch\dfs\Applications\Altium\Datasheets\IND_WURTH_WE-TPC_7440430022.pdf; Author: CERN DEM JLC; CreateDate: 2012-11-19; LatestRevisionDate: 2012-11-19
LED = LED_AVAGO_HSMC-C150: LED Red 1C 2A; Part Description: Surface Mount Red LED (1206 Case); Manufacturer: AVAGO TECHNOLOGIES; Table: LEDs & Displays; Part Number: LED_AVAGO_HSMC-C150; Component Kind: Standard; Component Type: Standard; Color: Red; PackageDescription: Red Chip LED, 2-Leads, Body 3.2 x1.6mm, IPC Medium Density; Manufacturer Part Number: HSMC-C150; Pin Count: 2; Case: 1206; Mounted: Yes; Socket: No; SMD: Yes; ComponentHeight: 1.2mm; HelpURL: \\cern.ch\dfs\Applications\Altium\Datasheets\LED_AVAGO_HSMC-C150.pdf; Author: CERN DEM JLC; CreateDate: 2013-06-18; LatestRevisionDate: 2013-06-18
POWER = SW_MENTOR_1850.1031: as MEASURMENT on sheet Procesor; Part Number: SW_MENTOR_1850.1031; Component Kind: Standard; Component Type: Standard; Pin Count: 3; PackageDescription: SPDT Switch - PCB Edge Mounting - MENTOR_1850; Family: Switch; Mounted: Yes; Socket: No; SMD: No; Status: None; Manufacturer Part Number: 1850.1031; ComponentHeight: 9.95mm; HelpURL: \\cern.ch\dfs\Applications\Altium\Datasheets\SW_MENTOR_1850.1031.pdf; Author: CERN DEM JMW; CreateDate: 2008-10-03; LatestRevisionDate: 2008-10-03
R2 = R0402_1R_1%_0.0625W_200PPM: Resistor - 1%; Part Description: General Purpose Thick Film Chip Resistor; Manufacturer: GENERIC; Manufacturer1 Part Number: 232270671008; TC: ±200ppm/°C; Table: Resistors SMD; Part Number: R0402_1R_1%_0.0625W_200PPM; Component Kind: Standard; Component Type: Standard; Pin Count: 2; Value: 1; Status: Not recommended; Power: 0.0625W; Tolerance: ±1%; Manufacturer Part Number: R0402_1R_1%_0.0625W_200PPM; Case: 0402; Mounted: Yes; Socket: No; SMD: Yes; Manufacturer1 Example: PHYCOMP; Manufacturer1 ComponentHeight: 0.4mm; HelpURL: \\cern.ch\dfs\Applications\Altium\Datasheets\R0402_Phycomp_RC0402.pdf; Author: CERN DEM JLC; CreateDate: 2007-12-03; LatestRevisionDate: 2009-06-24
R3 = R0603_1K74_0.1%_0.063W_10PPM: Resistor - 0.1%; Part Description: Thin Film Chip Resistor; Manufacturer: GENERIC; Manufacturer1 Part Number: RN73C1J1K74BTDF; Value: 1k74; Power: 0.063W; TC: ±10ppm; Table: Resistors SMD; Part Number: R0603_1K74_0.1%_0.063W_10PPM; Component Kind: Standard; Component Type: Standard; Pin Count: 2; Status: Not recommended; Tolerance: ±0.1%; Manufacturer Part Number: R0603_1K74_0.1%_0.063W_10PPM; Case: 0603; Mounted: Yes; Socket: No; SMD: Yes; Manufacturer1 Example: TYCO HOLSWORTHY; Manufacturer1 ComponentHeight: 0.5mm; HelpURL: \\cern.ch\dfs\Applications\Altium\Datasheets\R0603_Tyco_RN73.pdf; Author: CERN DEM JLC; CreateDate: 2007-12-03; LatestRevisionDate: 2008-03-13
R4 R11-R13 = R0402_10K_1%_0.0625W_100PPM: as R1 on sheet Procesor; Part Number: R0402_10K_1%_0.0625W_100PPM; Component Kind: Standard; Component Type: Standard; Pin Count: 2; Status: Not recommended; Power: 0.0625W; Tolerance: ±1%; Manufacturer Part Number: R0402_10K_1%_0.0625W_100PPM; Case: 0402; Mounted: Yes; Socket: No; SMD: Yes; Manufacturer1 Example: PHYCOMP; Manufacturer1 ComponentHeight: 0.4mm; HelpURL: \\cern.ch\dfs\Applications\Altium\Datasheets\R0402_Phycomp_RC0402.pdf; Author: CERN DEM JLC; CreateDate: 2007-12-03; LatestRevisionDate: 2008-03-13
  R4 R12 R13: Value: 10k
  R11: Value: 15k
R6 = R0402_510R_1%_0.0625W_100PPM: Resistor - 1%; Part Description: General Purpose Thick Film Chip Resistor; Manufacturer: GENERIC; Manufacturer1 Part Number: 232270675101; TC: ±100ppm/°C; Table: Resistors SMD; Part Number: R0402_510R_1%_0.0625W_100PPM; Component Kind: Standard; Component Type: Standard; Pin Count: 2; Value: 510; Status: Not recommended; Power: 0.0625W; Tolerance: ±1%; Manufacturer Part Number: R0402_510R_1%_0.0625W_100PPM; Case: 0402; Mounted: Yes; Socket: No; SMD: Yes; Manufacturer1 Example: PHYCOMP; Manufacturer1 ComponentHeight: 0.4mm; HelpURL: \\cern.ch\dfs\Applications\Altium\Datasheets\R0402_Phycomp_RC0402.pdf; Author: CERN DEM JLC; CreateDate: 2007-12-03; LatestRevisionDate: 2008-03-13
R7 = R0402_13K_1%_0.0625W_100PPM: Resistor - 1%; Part Description: General Purpose Thick Film Chip Resistor; Manufacturer: GENERIC; Manufacturer1 Part Number: 232270671303L; TC: ±100ppm/°C; Table: Resistors SMD; Part Number: R0402_13K_1%_0.0625W_100PPM; Component Kind: Standard; Component Type: Standard; Pin Count: 2; Value: 13k; Status: Not recommended; Power: 0.0625W; Tolerance: ±1%; Manufacturer Part Number: R0402_13K_1%_0.0625W_100PPM; Case: 0402; Mounted: Yes; Socket: No; SMD: Yes; Manufacturer1 Example: YAGEO PHYCOMP; Manufacturer1 ComponentHeight: 0.4mm; HelpURL: \\cern.ch\dfs\Applications\Altium\Datasheets\R0402_Phycomp_RC0402.pdf; Author: CERN DEM JLC; CreateDate: 2007-12-03; LatestRevisionDate: 2012-10-17
R9 = R0402_620R_1%_0.0625W_100PPM: as R25 on sheet ADCs; Part Number: R0402_620R_1%_0.0625W_100PPM; Component Kind: Standard; Component Type: Standard; Pin Count: 2; Status: Not recommended; Power: 0.0625W; Tolerance: ±1%; Manufacturer Part Number: R0402_620R_1%_0.0625W_100PPM; Case: 0402; Mounted: Yes; Socket: No; SMD: Yes; Manufacturer1 Example: YAGEO PHYCOMP; Manufacturer1 ComponentHeight: 0.4mm; HelpURL: \\cern.ch\dfs\Applications\Altium\Datasheets\R0402_Phycomp_RC0402.pdf; Author: CERN DEM JLC; CreateDate: 2007-12-03; LatestRevisionDate: 2012-10-17
R10 = R0402_200K_1%_0.0625W_100PPM: Resistor - 1%; Part Description: General Purpose Thick Film Chip Resistor; Manufacturer: GENERIC; Manufacturer1 Part Number: 232270672004L; TC: ±100ppm/°C; Table: Resistors SMD; Part Number: R0402_200K_1%_0.0625W_100PPM; Component Kind: Standard; Component Type: Standard; Pin Count: 2; Value: 200k; Status: Not recommended; Power: 0.0625W; Tolerance: ±1%; Manufacturer Part Number: R0402_200K_1%_0.0625W_100PPM; Case: 0402; Mounted: Yes; Socket: No; SMD: Yes; Manufacturer1 Example: YAGEO PHYCOMP; Manufacturer1 ComponentHeight: 0.4mm; HelpURL: \\cern.ch\dfs\Applications\Altium\Datasheets\R0402_Phycomp_RC0402.pdf; Author: CERN DEM JLC; CreateDate: 2007-12-03; LatestRevisionDate: 2012-10-17
R16 = R0402_75K_1%_0.0625W_100PPM: Resistor - 1%; Part Description: General Purpose Thick Film Chip Resistor; Manufacturer: GENERIC; Manufacturer1 Part Number: 232270677503L; TC: ±100ppm/°C; Table: Resistors SMD; Part Number: R0402_75K_1%_0.0625W_100PPM; Component Kind: Standard; Component Type: Standard; Pin Count: 2; Value: 75k; Status: Not recommended; Power: 0.0625W; Tolerance: ±1%; Manufacturer Part Number: R0402_75K_1%_0.0625W_100PPM; Case: 0402; Mounted: Yes; Socket: No; SMD: Yes; Manufacturer1 Example: YAGEO PHYCOMP; Manufacturer1 ComponentHeight: 0.4mm; HelpURL: \\cern.ch\dfs\Applications\Altium\Datasheets\R0402_Phycomp_RC0402.pdf; Author: CERN DEM JLC; CreateDate: 2007-12-03; LatestRevisionDate: 2012-10-17
U4 = LTC3558: USB Buck-Boost Charger
USB = CON_USB_AB_MICRO: USB micro AB connector; Part Number: 10133; Device: USB_Mini_AB

## Nets that join several sheets
+3V3: Procesor (15 pins), U1_A (10 pins), U1_B (10 pins), U1_C (10 pins), U1_D (10 pins), Zasilanie (C14.1 R9.1 U4.11)
BAT: Procesor (IC1.3), Zasilanie (7 pins)
GND: Procesor (40 pins), U1_A (14 pins), U1_B (14 pins), U1_C (14 pins), U1_D (14 pins), Zasilanie (13 pins)
Vbus: Procesor (C23.1 D4.4 U3.8), Zasilanie (5 pins)
ADS_Start: Procesor (U2.7), U1_A (U1A.23), U1_B (U1B.23), U1_C (U1C.23), U1_D (U1D.23)
CS: Procesor (R19.2 SD_CON.2 U2.8), U1_A (U1A.24), U1_B (U1B.24), U1_C (U1C.24), U1_D (U1D.24)
DM: Procesor (D4.3 U3.5), Zasilanie (USB.3)
DP: Procesor (D4.2 U3.4), Zasilanie (USB.2)
HPWR: Procesor (U2.30), Zasilanie (U4.16)
MISO: Procesor (R22.2 SD_CON.7 U2.17), U1_A (U1A.26), U1_B (U1B.26), U1_C (U1C.26), U1_D (U1D.26)
MODE: Procesor (U2.26), Zasilanie (U4.3)
MOSI: Procesor (R20.2 R43.1 SD_CON.3 U2.18), U1_A (U1A.27), U1_B (U1B.27), U1_C (U1C.27), U1_D (U1D.27)
NetD1A_1: Procesor (HDMI1.1 HDMI1.4 HDMI1.7 HDMI1.10), U1_A (6 pins)
NetD1A_3: Procesor (HDMI1.2), U1_A (D1A.3 U1A.16)
NetD1A_6: Procesor (HDMI1.3), U1_A (D1A.6 U1A.15)
NetD1B_1: Procesor (HDMI1.13 HDMI1.16 HDMI2.1 HDMI2.4), U1_B (6 pins)
NetD1B_3: Procesor (HDMI1.14), U1_B (D1B.3 U1B.16)
NetD1B_6: Procesor (HDMI1.15), U1_B (D1B.6 U1B.15)
NetD1C_1: Procesor (HDMI2.7 HDMI2.10 HDMI2.13 HDMI2.16), U1_C (6 pins)
NetD1C_3: Procesor (HDMI2.8), U1_C (D1C.3 U1C.16)
NetD1C_6: Procesor (HDMI2.9), U1_C (D1C.6 U1C.15)
NetD1D_1: Procesor (HDMI3.1 HDMI3.4 HDMI3.7 HDMI3.10), U1_D (6 pins)
NetD1D_3: Procesor (HDMI3.2), U1_D (D1D.3 U1D.16)
NetD1D_6: Procesor (HDMI3.3), U1_D (D1D.6 U1D.15)
NetD2A_1: Procesor (HDMI1.5), U1_A (D2A.1 U1A.14)
NetD2A_3: Procesor (HDMI1.6), U1_A (D2A.3 U1A.13)
NetD2A_4: Procesor (HDMI1.8), U1_A (D2A.4 U1A.18)
NetD2B_1: Procesor (HDMI1.17), U1_B (D2B.1 U1B.14)
NetD2B_3: Procesor (HDMI1.18), U1_B (D2B.3 U1B.13)
NetD2B_4: Procesor (HDMI2.2), U1_B (D2B.4 U1B.18)
NetD2C_1: Procesor (HDMI2.11), U1_C (D2C.1 U1C.14)
NetD2C_3: Procesor (HDMI2.12), U1_C (D2C.3 U1C.13)
NetD2C_4: Procesor (HDMI2.14), U1_C (D2C.4 U1C.18)
NetD2D_1: Procesor (HDMI3.5), U1_D (D2D.1 U1D.14)
NetD2D_3: Procesor (HDMI3.6), U1_D (D2D.3 U1D.13)
NetD2D_4: Procesor (HDMI3.8), U1_D (D2D.4 U1D.18)
NetD3A_1: Procesor (HDMI1.9), U1_A (D3A.1 U1A.17)
NetD3A_4: Procesor (HDMI1.12), U1_A (D3A.4 U1A.11)
NetD3A_6: Procesor (HDMI1.11), U1_A (D3A.6 U1A.12)
NetD3B_1: Procesor (HDMI2.3), U1_B (D3B.1 U1B.17)
NetD3B_4: Procesor (HDMI2.6), U1_B (D3B.4 U1B.11)
NetD3B_6: Procesor (HDMI2.5), U1_B (D3B.6 U1B.12)
NetD3C_1: Procesor (HDMI2.15), U1_C (D3C.1 U1C.17)
NetD3C_4: Procesor (HDMI2.18), U1_C (D3C.4 U1C.11)
NetD3C_6: Procesor (HDMI2.17), U1_C (D3C.6 U1C.12)
NetD3D_1: Procesor (HDMI3.9), U1_D (D3D.1 U1D.17)
NetD3D_4: Procesor (HDMI3.12), U1_D (D3D.4 U1D.11)
NetD3D_6: Procesor (HDMI3.11), U1_D (D3D.6 U1D.12)
SCLK: Procesor (R21.2 R44.1 SD_CON.5 U2.15), U1_A (U1A.28), U1_B (U1B.28), U1_C (U1C.28), U1_D (U1D.28)